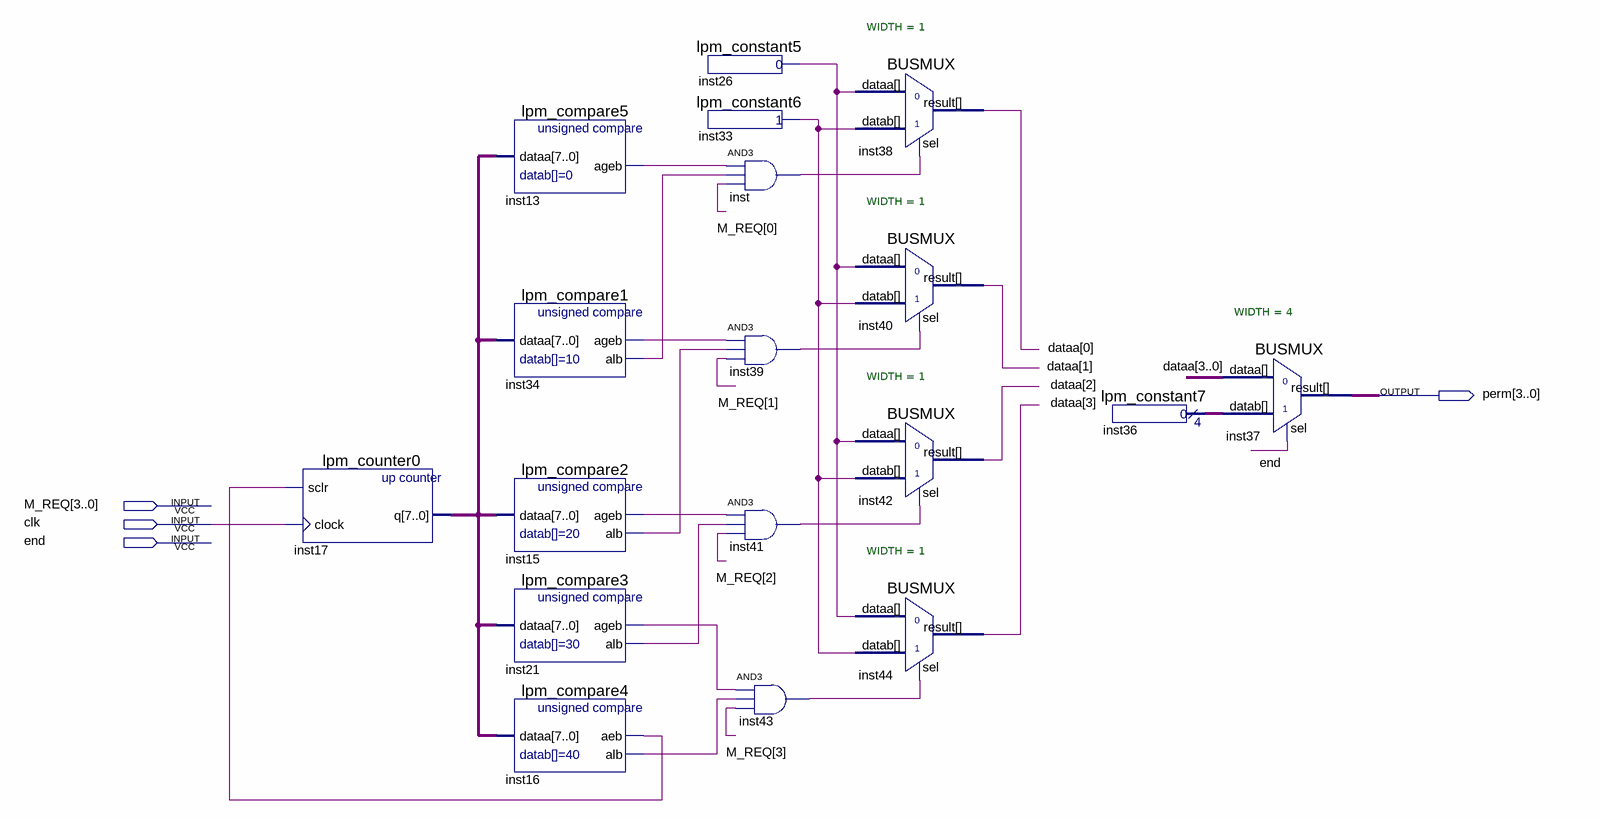
[diagram p0: schematic sheet]
// Quartus schematic Arbiter.bdf as structural Verilog: 18 symbols, 4 pins
module Arbiter (
  input  [3:0] M_REQ,
  input  clk,
  input  \end ,
  output [3:0] perm
);

  wire inst13_ageb, inst15_ageb, inst15_alb, inst16_aeb, inst16_alb, inst21_ageb, inst21_alb, inst26_result,
       inst33_result, inst34_ageb, inst34_alb, inst39_out, inst41_out, inst43_out, inst_out;
  wire [3:0] dataa, inst36_result;
  wire [7:0] inst17_q;

  lpm_counter0 inst17 (.sclr(inst16_aeb), .clock(clk), .q(inst17_q));
  lpm_compare5 inst13 (.dataa(inst17_q), .ageb(inst13_ageb));
  lpm_compare1 inst34 (.dataa(inst17_q), .ageb(inst34_ageb), .alb(inst34_alb));
  lpm_compare2 inst15 (.dataa(inst17_q), .ageb(inst15_ageb), .alb(inst15_alb));
  lpm_compare3 inst21 (.dataa(inst17_q), .ageb(inst21_ageb), .alb(inst21_alb));
  lpm_compare4 inst16 (.dataa(inst17_q), .aeb(inst16_aeb), .alb(inst16_alb));
  lpm_constant5 inst26 (.result(inst26_result));
  lpm_constant6 inst33 (.result(inst33_result));
  and inst (inst_out, inst13_ageb, inst34_alb, M_REQ[0]);
  and inst39 (inst39_out, inst34_ageb, inst15_alb, M_REQ[1]);
  and inst41 (inst41_out, inst15_ageb, inst21_alb, M_REQ[2]);
  and inst43 (inst43_out, inst21_ageb, inst16_alb, M_REQ[3]);
  BUSMUX #(.WIDTH(1)) inst38 (.datab(inst33_result), .sel(inst_out), .dataa(inst26_result), .result(dataa[0]));
  BUSMUX #(.WIDTH(1)) inst40 (.datab(inst33_result), .sel(inst39_out), .dataa(inst26_result), .result(dataa[1]));
  BUSMUX #(.WIDTH(1)) inst42 (.datab(inst33_result), .sel(inst41_out), .dataa(inst26_result), .result(dataa[2]));
  BUSMUX #(.WIDTH(1)) inst44 (.datab(inst33_result), .sel(inst43_out), .dataa(inst26_result), .result(dataa[3]));
  lpm_constant7 inst36 (.result(inst36_result));
  BUSMUX #(.WIDTH(4)) inst37 (.datab(inst36_result), .sel(\end ), .dataa(dataa), .result(perm));
endmodule
